# EasyEDA schematic SCH_Electronica-Digital-Corte-3-Sara-Nuñez-Julian-Patiño_2024-11-26.json
TITLE: Sheet_1; REV: 1.0; Date: 2024-10-31; Sheet: 1/1; Drawn By: julianp2004; Company: Your Company
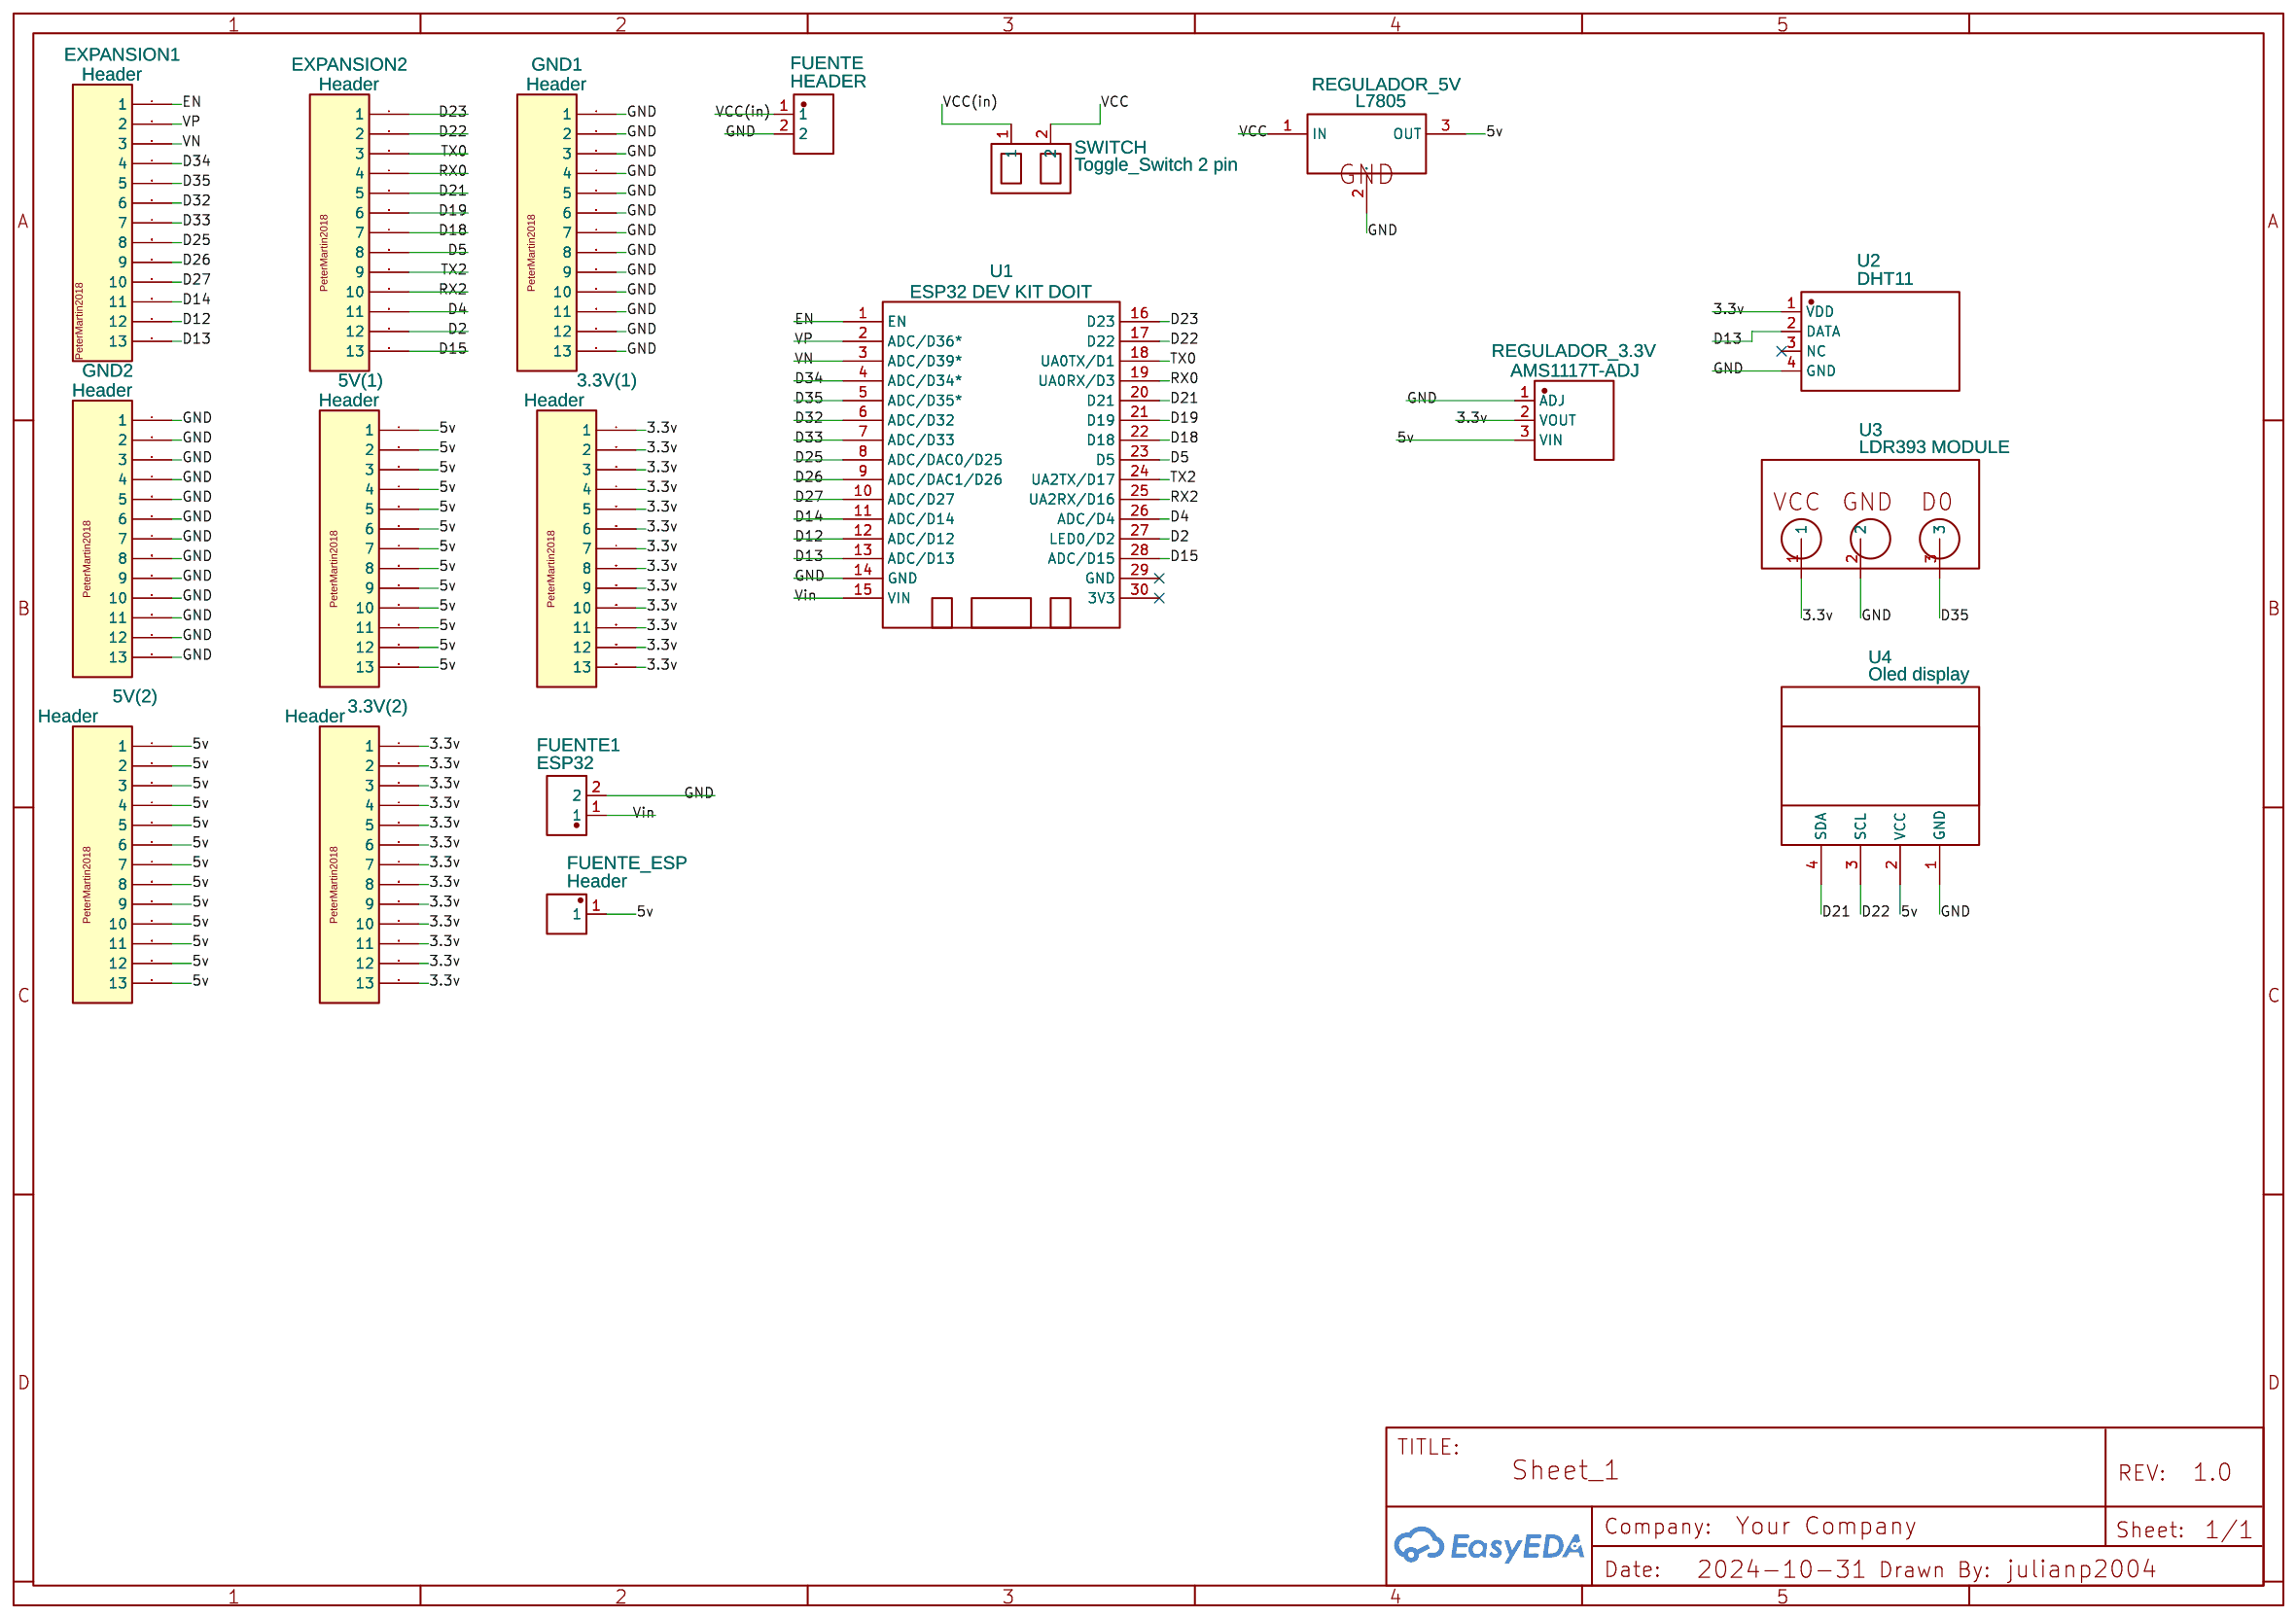
[diagram p0: schematic sheet]

## Parts
3.3V(1)  Header  [HEADER_13]
3.3V(2)  Header  [HEADER_13]
5V(1)  Header  [HEADER_13]
5V(2)  Header  [HEADER_13]
EXPANSION1  Header  [HEADER_13]
EXPANSION2  Header  [HEADER_13]
FUENTE  HEADER  [PIN HEADER MACHO 1X2 180]
FUENTE1  ESP32  [PIN HEADER MACHO 1X2 180]
FUENTE_ESP  Header  [HEADER-HEADER-FEMALE-2.54_1X1]
GND1  Header  [HEADER_13]
GND2  Header  [HEADER_13]
REGULADOR_3.3V  AMS1117T-ADJ  [TO-220-3_L10.0-W4.5-P2.54-L]
REGULADOR_5V  L7805  [TO-220-3_L10.0-W4.5-P2.54-L]
SWITCH  Toggle_Switch 2 pin  [TOGGLE_SWITCH 2 PIN]
U1  ESP32 DEV KIT DOIT  [DOIT-ESP32-DEVKIT-V1]
U2  DHT11  [SENSOR-TH_DHT11]
U3  LDR393 MODULE  [LDR MODULE]
U4  Oled display  [OLED1306]

## Library data of the parts
3.3V(1) 3.3V(2) 5V(1) 5V(2) EXPANSION1 EXPANSION2 GND1 GND2 = Header 13 copy: Contributor: PedroM; Supplier: Altronics; Manufacturer Part: Altronics
FUENTE FUENTE1 = PIN HEADER MACHO 1X2 180: Contributor: LCSC
FUENTE_ESP = HEADER - 2.54_1X1 FEM COPY: Supplier: Private; Contributor: MaxTheTraveller (Essper)
REGULADOR_3.3V = AMS1117T-ADJ: Contributor: LCSC; Supplier: LCSC; Supplier Part: C498133; Manufacturer: HGC(华冠); JLCPCB Part Class: Extended Part
REGULADOR_5V = L7805CV-HXY: Contributor: lcsc; Supplier: LCSC; Supplier Part: C7469132; Manufacturer: HXY MOSFET(华轩阳电子); JLCPCB Part Class: Extended Part
SWITCH = Toggle_Switch 2 pin: Contributor: arthurhb
U1 = ESP32 DEV KIT DOIT: Contributor: ConceitoTeam
U2 = DHT11: Contributor: LCSC; Supplier: LCSC; Supplier Part: C117051; Manufacturer: 广州奥松; JLCPCB Part Class: Extended Part
U3 = LDR393 MODULE: Contributor: Gaurav Virmani
U4 = Oled display: Contributor: kilovoctor

## Nets
3.3v: 3.3V(1).1 3.3V(1).2 3.3V(1).3 3.3V(1).4 3.3V(1).5 3.3V(1).6 3.3V(1).7 3.3V(1).8 3.3V(1).9 3.3V(1).10 3.3V(1).11 3.3V(1).12 3.3V(1).13 3.3V(2).1 3.3V(2).2 3.3V(2).3 3.3V(2).4 3.3V(2).5 3.3V(2).6 3.3V(2).7 3.3V(2).8 3.3V(2).9 3.3V(2).10 3.3V(2).11 3.3V(2).12 3.3V(2).13 REGULADOR_3.3V.2(VOUT) U2.1(VDD) U3.1
5v: 5V(1).1 5V(1).2 5V(1).3 5V(1).4 5V(1).5 5V(1).6 5V(1).7 5V(1).8 5V(1).9 5V(1).10 5V(1).11 5V(1).12 5V(1).13 5V(2).1 5V(2).2 5V(2).3 5V(2).4 5V(2).5 5V(2).6 5V(2).7 5V(2).8 5V(2).9 5V(2).10 5V(2).11 5V(2).12 5V(2).13 FUENTE_ESP.1 REGULADOR_3.3V.3(VIN) REGULADOR_5V.3(OUT) U4.2(VCC)
GND: FUENTE.2 FUENTE1.2 GND1.1 GND1.2 GND1.3 GND1.4 GND1.5 GND1.6 GND1.7 GND1.8 GND1.9 GND1.10 GND1.11 GND1.12 GND1.13 GND2.1 GND2.2 GND2.3 GND2.4 GND2.5 GND2.6 GND2.7 GND2.8 GND2.9 GND2.10 GND2.11 GND2.12 GND2.13 REGULADOR_3.3V.1(ADJ) REGULADOR_5V.2(GND) U1.14(GND) U2.4(GND) U3.2 U4.1(GND)
VCC: REGULADOR_5V.1(IN) SWITCH.2
VCC(in): FUENTE.1 SWITCH.1
Vin: FUENTE1.1 U1.15(VIN)
D2: EXPANSION2.12 U1.27(LED0/D2)
D4: EXPANSION2.11 U1.26(ADC/D4)
D5: EXPANSION2.8 U1.23(D5)
D12: EXPANSION1.12 U1.12(ADC/D12)
D13: EXPANSION1.13 U1.13(ADC/D13) U2.2(DATA)
D14: EXPANSION1.11 U1.11(ADC/D14)
D15: EXPANSION2.13 U1.28(ADC/D15)
D18: EXPANSION2.7 U1.22(D18)
D19: EXPANSION2.6 U1.21(D19)
D21: EXPANSION2.5 U1.20(D21) U4.4(SDA)
D22: EXPANSION2.2 U1.17(D22) U4.3(SCL)
D23: EXPANSION2.1 U1.16(D23)
D25: EXPANSION1.8 U1.8(ADC/DAC0/D25)
D26: EXPANSION1.9 U1.9(ADC/DAC1/D26)
D27: EXPANSION1.10 U1.10(ADC/D27)
D32: EXPANSION1.6 U1.6(ADC/D32)
D33: EXPANSION1.7 U1.7(ADC/D33)
D34: EXPANSION1.4 U1.4(ADC/D34*)
D35: EXPANSION1.5 U1.5(ADC/D35*) U3.3
EN: EXPANSION1.1 U1.1(EN)
RX0: EXPANSION2.4 U1.19(UA0RX/D3)
RX2: EXPANSION2.10 U1.25(UA2RX/D16)
TX0: EXPANSION2.3 U1.18(UA0TX/D1)
TX2: EXPANSION2.9 U1.24(UA2TX/D17)
VN: EXPANSION1.3 U1.3(ADC/D39*)
VP: EXPANSION1.2 U1.2(ADC/D36*)

Not connected (* = marked no-connect by the designer): U1 29(GND)* 30(3V3)*; U2 3(NC)*
